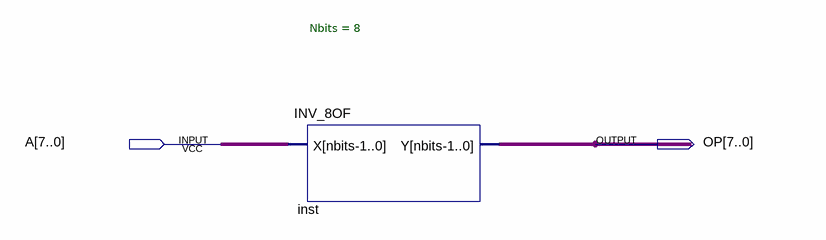
[diagram p0: schematic sheet]
// Quartus schematic top_level.bdf as structural Verilog: 1 symbols, 2 pins
module top_level (
  input  [7:0] A,
  output [7:0] OP
);

  INV_8OF #(.Nbits(8)) inst (.X(A), .Y(OP));
endmodule
